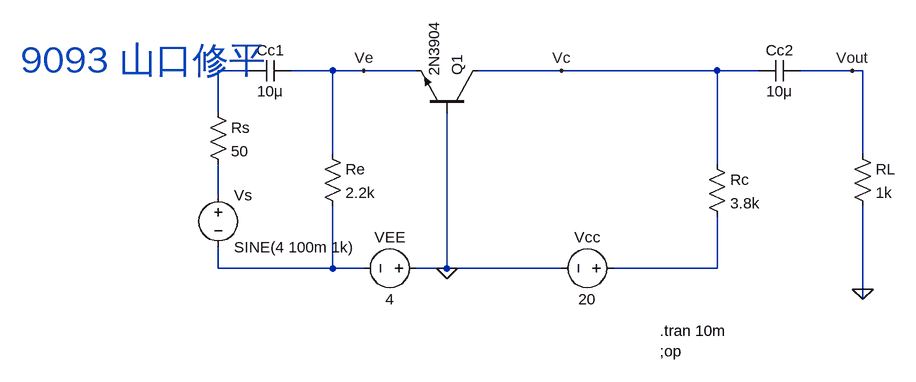
[diagram p0: schematic Draft1.asc]
Draft1.asc, the LTspice schematic file:
Version 4
SHEET 1 884 680
WIRE -112 -16 -160 -16
WIRE 16 -16 -48 -16
WIRE 64 -16 16 -16
WIRE 144 -16 64 -16
WIRE 368 -16 240 -16
WIRE 608 -16 368 -16
WIRE 672 -16 608 -16
WIRE 816 -16 736 -16
WIRE 832 -16 816 -16
WIRE -160 48 -160 -16
WIRE 16 112 16 -16
WIRE 832 112 832 -16
WIRE 608 128 608 -16
WIRE -160 176 -160 128
WIRE -160 288 -160 256
WIRE 16 288 16 192
WIRE 16 288 -160 288
WIRE 64 288 16 288
WIRE 192 288 192 48
WIRE 192 288 144 288
WIRE 368 288 192 288
WIRE 608 288 608 208
WIRE 608 288 448 288
WIRE 832 320 832 192
WIRE 832 336 832 320
FLAG 832 320 0
FLAG 192 288 0
FLAG 368 -16 Vc
FLAG 64 -16 Ve
FLAG 816 -16 Vout
SYMBOL npn 240 48 M270
SYMATTR InstName Q1
SYMATTR Value 2N3904
SYMBOL voltage 464 288 R90
WINDOW 0 -32 56 VBottom 2
WINDOW 3 32 56 VTop 2
SYMATTR InstName Vcc
SYMATTR Value 20
SYMBOL res 592 112 R0
SYMATTR InstName Rc
SYMATTR Value 3.8k
SYMBOL res 816 96 R0
SYMATTR InstName RL
SYMATTR Value 1k
SYMBOL res 0 96 R0
SYMATTR InstName Re
SYMATTR Value 2.2k
SYMBOL res -176 32 R0
SYMATTR InstName Rs
SYMATTR Value 50
SYMBOL voltage -160 160 R0
SYMATTR InstName Vs
SYMATTR Value SINE(4 100m 1k)
SYMBOL cap -48 -32 R90
WINDOW 0 0 32 VBottom 2
WINDOW 3 32 32 VTop 2
SYMATTR InstName Cc1
SYMATTR Value 10μ
SYMBOL cap 736 -32 R90
WINDOW 0 0 32 VBottom 2
WINDOW 3 32 32 VTop 2
SYMATTR InstName Cc2
SYMATTR Value 10μ
SYMBOL voltage 160 288 R90
WINDOW 0 -32 56 VBottom 2
WINDOW 3 32 56 VTop 2
SYMATTR InstName VEE
SYMATTR Value 4
TEXT 520 384 Left 2 !.tran 10m
TEXT 520 416 Left 2 !;op
TEXT -464 -32 Left 5 ;9093 山口修平

The netlist it stands for:
* Draft1.asc
Q1 Vc 0 Ve 0 2N3904
Vcc N004 0 20
Rc Vc N004 3.8k
RL Vout 0 1k
Re Ve N003 2.2k
Rs N001 N002 50
Vs N002 N003 SINE(4 100m 1k)
Cc1 Ve N001 10μ
Cc2 Vout Vc 10μ
VEE 0 N003 4
.model NPN NPN
.model PNP PNP
.lib standard.bjt
.tran 10m
;op
* 9093 山口修平
.backanno
.end